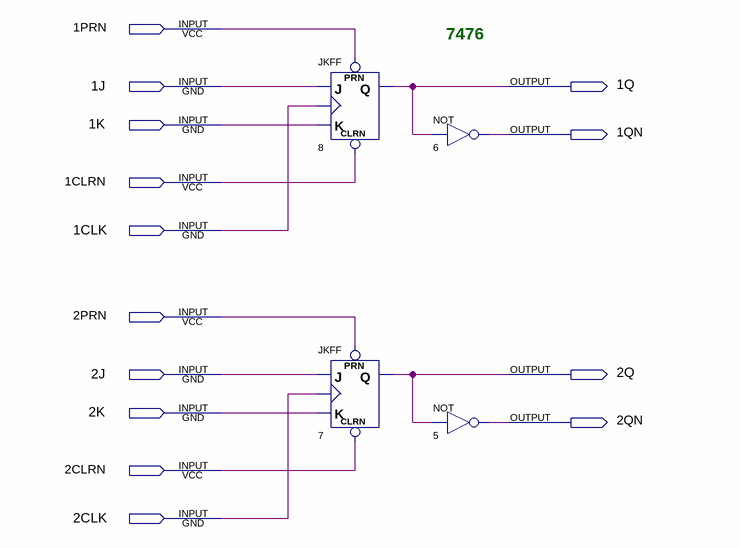
[diagram p0: schematic sheet]
// Quartus schematic 7476.bdf as structural Verilog: 4 symbols, 14 pins
module \7476  (
  input  \1PRN ,
  input  \1J ,
  input  \1K ,
  input  \1CLRN ,
  input  \1CLK ,
  input  \2PRN ,
  input  \2J ,
  input  \2K ,
  input  \2CLRN ,
  input  \2CLK ,
  output \1Q ,
  output \1QN ,
  output \2Q ,
  output \2QN 
);

  JKFF u_8 (.PRN(\1PRN ), .CLRN(\1CLRN ), .K(\1K ), .J(\1J ), .CLK(\1CLK ), .Q(\1Q ));
  JKFF u_7 (.PRN(\2PRN ), .CLRN(\2CLRN ), .K(\2K ), .J(\2J ), .CLK(\2CLK ), .Q(\2Q ));
  not u_6 (\1QN , \1Q );
  not u_5 (\2QN , \2Q );

  // Notes on the sheet:
  //   7476
endmodule
